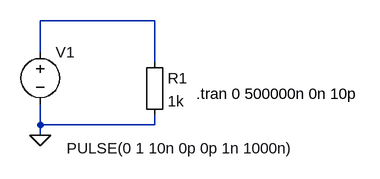
[diagram p0: schematic impulseTrain.asc]
impulseTrain.asc, the LTspice schematic file:
Version 4
SHEET 1 880 680
WIRE 256 64 80 64
WIRE 80 112 80 64
WIRE 256 128 256 64
WIRE 80 224 80 192
WIRE 256 224 256 208
WIRE 256 224 80 224
WIRE 80 240 80 224
FLAG 80 240 0
SYMBOL voltage 80 96 R0
WINDOW 3 41 164 Left 2
WINDOW 123 0 0 Left 2
WINDOW 39 0 0 Left 2
SYMATTR Value PULSE(0 1 10n 0p 0p 1n 1000n)
SYMATTR InstName V1
SYMBOL Misc\\EuropeanResistor 240 112 R0
SYMATTR InstName R1
SYMATTR Value 1k
TEXT 320 176 Left 2 !.tran 0 500000n 0n 10p

The netlist it stands for:
* impulseTrain.asc
V1 N001 0 PULSE(0 1 10n 0p 0p 1n 1000n)
R1 N001 0 1k
.tran 0 500000n 0n 10p
.backanno
.end